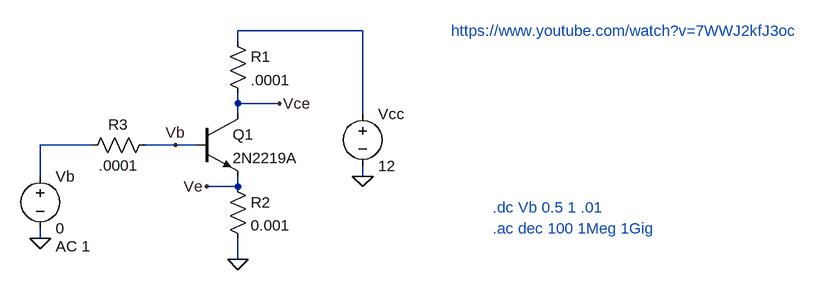
[diagram p0: schematic 2n2219 Input Characteristic Curve.asc]
2n2219 Input Characteristic Curve.asc, the LTspice schematic file:
Version 4
SHEET 1 1232 680
WIRE 448 16 256 16
WIRE 256 32 256 16
WIRE 256 128 256 112
WIRE 320 128 256 128
WIRE 256 144 256 128
WIRE 448 144 448 16
WIRE 32 192 -48 192
WIRE 160 192 112 192
WIRE 192 192 160 192
WIRE -48 240 -48 192
WIRE 448 240 448 224
WIRE 256 256 256 240
WIRE 256 256 208 256
WIRE -48 336 -48 320
WIRE 256 368 256 336
FLAG 256 368 0
FLAG 448 240 0
FLAG -48 336 0
FLAG 320 128 Vce
FLAG 208 256 Ve
FLAG 160 192 Vb
SYMBOL npn 192 144 R0
SYMATTR InstName Q1
SYMATTR Value 2N2219A
SYMBOL voltage 448 128 R0
WINDOW 123 0 0 Left 2
WINDOW 39 0 0 Left 2
SYMATTR InstName Vcc
SYMATTR Value 12
SYMBOL voltage -48 224 R0
WINDOW 123 24 124 Left 2
WINDOW 39 0 0 Left 2
SYMATTR Value2 AC 1
SYMATTR InstName Vb
SYMATTR Value 0
SYMBOL res 240 16 R0
SYMATTR InstName R1
SYMATTR Value .0001
SYMBOL res 240 240 R0
SYMATTR InstName R2
SYMATTR Value 0.001
SYMBOL res 128 176 R90
WINDOW 0 0 56 VBottom 2
WINDOW 3 32 56 VTop 2
SYMATTR InstName R3
SYMATTR Value .0001
TEXT 648 288 Left 2 ;.dc Vb 0.5 1 .01
TEXT 584 16 Left 2 ;https://www.youtube.com/watch?v=7WWJ2kfJ3oc
TEXT 648 320 Left 2 ;.ac dec 100 1Meg 1Gig

The netlist it stands for:
* 2n2219 Input Characteristic Curve.asc
Q1 Vce Vb Ve 0 2N2219A
Vcc N001 0 12
Vb N002 0 0 AC 1
R1 N001 Vce .0001
R2 Ve 0 0.001
R3 Vb N002 .0001
.model NPN NPN
.model PNP PNP
.lib standard.bjt
* .dc Vb 0.5 1 .01
* https://www.youtube.com/watch?v=7WWJ2kfJ3oc
* .ac dec 100 1Meg 1Gig
.backanno
.end